# Altium project template.PrjPcb
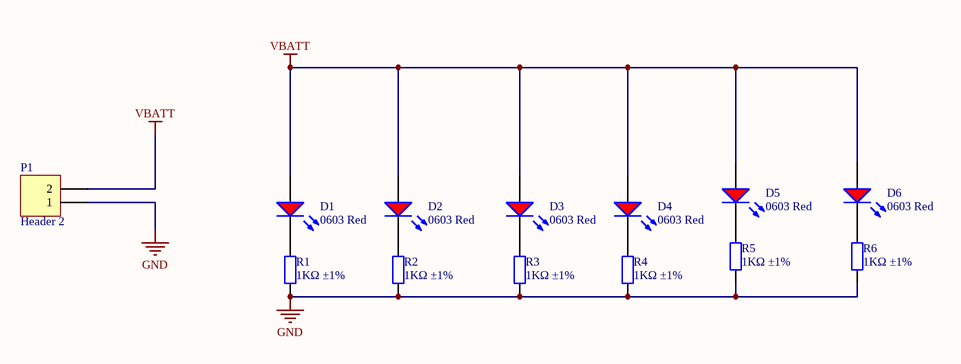
[diagram p0: TOP.SchDoc]
1 sheet, 13 parts. Net scope: global (net labels, ports and power ports of the same name join across sheets).
Board file: PCB.PcbDoc

## Sheet TOP.SchDoc: =DocumentName
size A4; Organization: Queen's Formula SAE; Address1: 130 Stuart St, Kingston; Address2: Ontario; Address3: Canada; Address4: K7L 2V9; DocumentNumber: 1; Revision: 0; SheetNumber: 1; SheetTotal: 1

### Parts
D1  0603 Red  [0603_LED_S1]
D2  0603 Red  [0603_LED_S1]
D3  0603 Red  [0603_LED_S1]
D4  0603 Red  [0603_LED_S1]
D5  0603 Red  [0603_LED_S1]
D6  0603 Red  [0603_LED_S1]
P1  Header 2  [HDR1X2]
R1  1KΩ ±1%  [0402_R]
R2  1KΩ ±1%  [0402_R]
R3  1KΩ ±1%  [0402_R]
R4  1KΩ ±1%  [0402_R]
R5  1KΩ ±1%  [0402_R]
R6  1KΩ ±1%  [0402_R]

### Nets
GND: P1.1 R1.1 R2.1 R3.1 R4.1 R5.1 R6.1
VBATT: D1.A D2.A D3.A D4.A D5.A D6.A P1.2
NetD1_K: D1.K R1.2
NetD2_K: D2.K R2.2
NetD3_K: D3.K R3.2
NetD4_K: D4.K R4.2
NetD5_K: D5.K R5.2
NetD6_K: D6.K R6.2

### Notes on the sheet
- Title
- Size:
- Date:
- A4
- Number:
- Time:
- Revision:
- Sheet
- of
- File:

### Library data of the parts
D1-D6 = 0603 LED Red: LED; ComponentLink1Description: 供应商链接; ComponentLink1URL: http://www.szlcsc.com/product/details_2659.html; Package: 0603; Supplier: LC; SuppliersPartNumber: C2286; Color: Red
P1 = Header 2: Header, 2-Pin; LatestRevisionDate: 17-Jul-2002; LatestRevisionNote: Re-released for DXP Platform.; Publisher: Altium Limited
R1-R6 = 0402 1K (1001) 1%: Chip resistor; Manufacturer: Uniroyal Elec; PartNumber: 0402WGF1001TCE; Power: 1/16W; ComponentLink1Description: Supplier link; ComponentLink1URL: http://www.szlcsc.com/product/details_12256.html; Package: 0402; Supplier: LC; SuppliersPartNumber: C11702; Resistance: 1KΩ; Tolerance: 1%